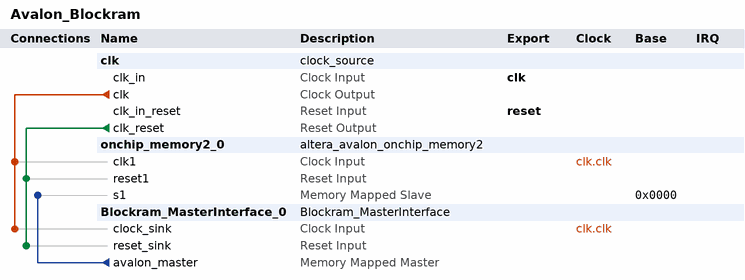
[diagram p0: system contents]
# Platform Designer (Qsys) system Avalon_Blockram, Cyclone II EP2C70F896C6
# Parameters at their usual value, and those the tool derives, are not listed.
package require -exact qsys 13.0
create_system Avalon_Blockram
set_project_property DEVICE_FAMILY {Cyclone II}
set_project_property DEVICE EP2C70F896C6

add_instance clk clock_source 13.0
set_instance_parameter_value clk clockFrequency 50000000

add_instance onchip_memory2_0 altera_avalon_onchip_memory2 13.0.1.99.2
set_instance_parameter_value onchip_memory2_0 dataWidth 32
set_instance_parameter_value onchip_memory2_0 dualPort false
set_instance_parameter_value onchip_memory2_0 initMemContent true
set_instance_parameter_value onchip_memory2_0 initializationFileName onchip_mem.hex
set_instance_parameter_value onchip_memory2_0 memorySize 1024

add_instance Blockram_MasterInterface_0 Blockram_MasterInterface 1.0

# connections
add_connection clk.clk Blockram_MasterInterface_0.clock_sink clock
add_connection clk.clk onchip_memory2_0.clk1 clock
add_connection clk.clk_reset Blockram_MasterInterface_0.reset_sink reset
add_connection clk.clk_reset onchip_memory2_0.reset1 reset
add_connection Blockram_MasterInterface_0.avalon_master onchip_memory2_0.s1 avalon
set_connection_parameter_value Blockram_MasterInterface_0.avalon_master/onchip_memory2_0.s1 baseAddress 0x0000

# exported interfaces
add_interface clk clock sink
set_interface_property clk EXPORT_OF clk.clk_in
add_interface reset reset sink
set_interface_property reset EXPORT_OF clk.clk_in_reset

set_interconnect_requirement {$system} qsys_mm.clockCrossingAdapter HANDSHAKE
set_interconnect_requirement {$system} qsys_mm.maxAdditionalLatency 1

save_system Avalon_Blockram.qsys
